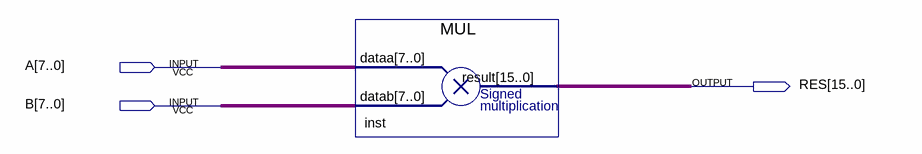
[diagram p0: schematic sheet]
// Quartus schematic 8_Bit_Mul.bdf as structural Verilog: 1 symbols, 3 pins
module \8_Bit_Mul  (
  input  [7:0] A,
  input  [7:0] B,
  output [15:0] RES
);

  MUL inst (.dataa(A), .datab(B), .result(RES));
endmodule
